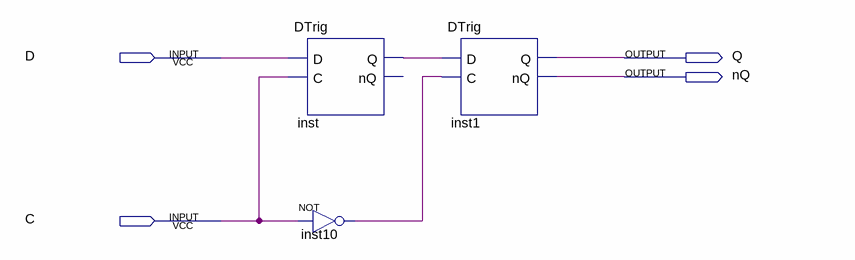
[diagram p0: schematic sheet]
// Quartus schematic DTrigWRE.bdf as structural Verilog: 3 symbols, 4 pins
module DTrigWRE (
  input  D,
  input  C,
  output Q,
  output nQ
);

  wire inst10_out, inst_q;

  DTrig inst (.D(D), .C(C), .Q(inst_q));  // open: nQ
  not inst10 (inst10_out, C);
  DTrig inst1 (.D(inst_q), .C(inst10_out), .Q(Q), .nQ(nQ));
endmodule
